# Altium schematic sheet Main.SchDoc
size A; SheetNumber: 1; SheetTotal: 6
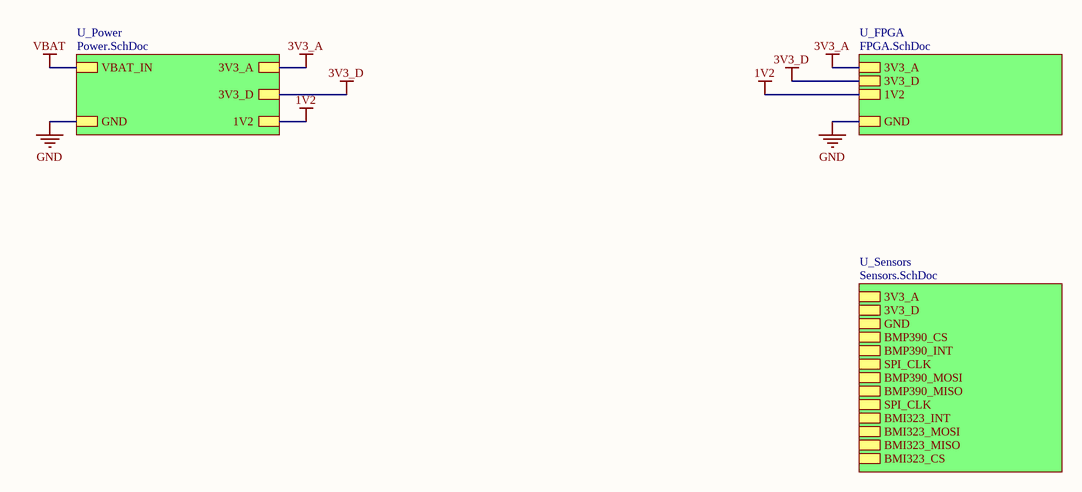
[diagram p0: Main.SchDoc]

## Sub-sheets
U_FPGA = FPGA.SchDoc: 3V3_A, 3V3_D, 1V2, GND
U_Power = Power.SchDoc: VBAT_IN, GND, 3V3_A, 3V3_D, 1V2
U_Sensors = Sensors.SchDoc: 3V3_A, 3V3_D, GND, BMP390_CS, BMP390_INT, SPI_CLK, BMP390_MOSI, BMP390_MISO, SPI_CLK, BMI323_INT, BMI323_MOSI, BMI323_MISO, BMI323_CS

## Nets
1V2: sheet U_FPGA/1V2, sheet U_Power/1V2
3V3_A: sheet U_FPGA/3V3_A, sheet U_Power/3V3_A
3V3_D: sheet U_FPGA/3V3_D, sheet U_Power/3V3_D
GND: sheet U_FPGA/GND, sheet U_Power/GND
VBAT: sheet U_Power/VBAT_IN